# Altium schematic sheet CONNECTEUR_3.SchDoc: DARKYDEN_CONNECTEUR_3
size Letter; ApprovedBy: APPROUVÉ PAR; Author: Harold Malbrouck; Organization: Cegep Limoilou; Address1: 1300, 8e Avenue; Address2: Québec, QC; Address3: Canada; Address4: G1J 5L5; Revision: Rev.C; SheetNumber: 5; SheetTotal: 23
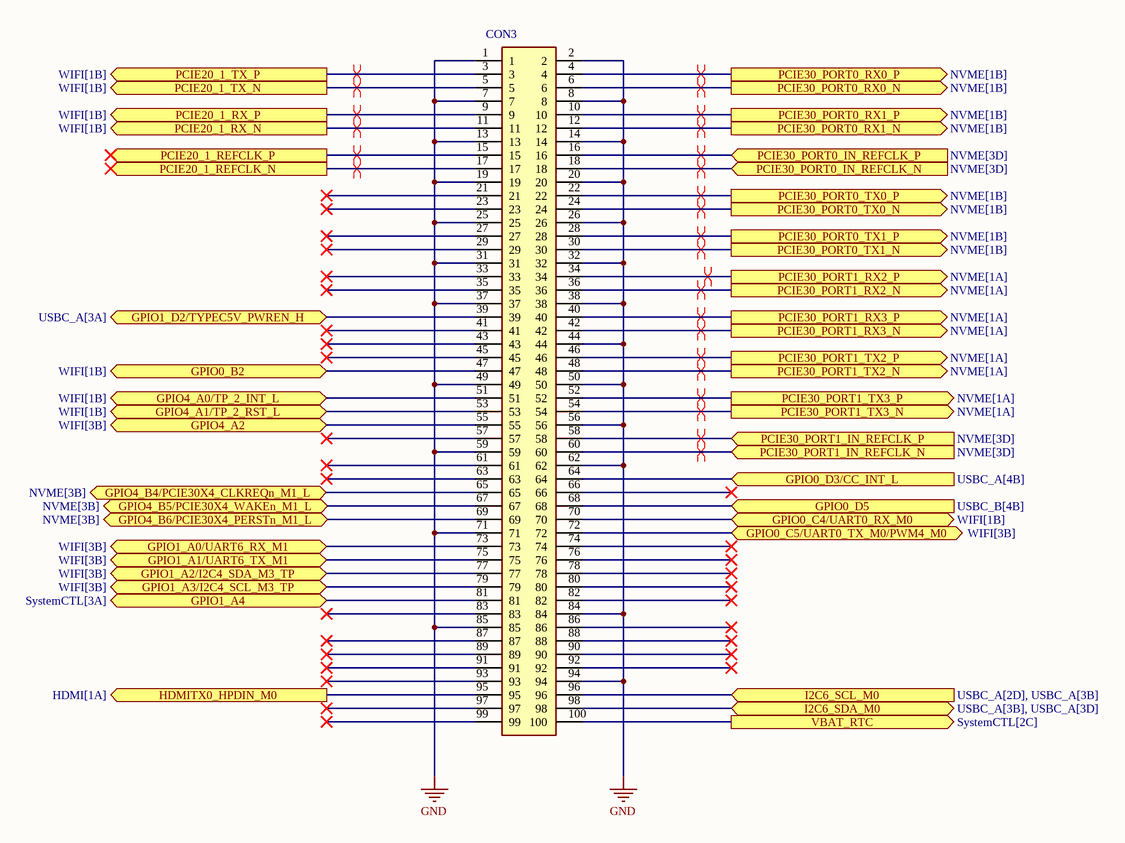
[diagram p0: CONNECTEUR_3.SchDoc]

## Parts
CON3  DF40HC  [DF40HC30100DS04V51_MOD]  (value not drawn)

## Ports
GPIO0_B2 (bidir, see WIFI[1B]), GPIO0_C4/UART0_RX_M0 (bidir, see WIFI[1B]), GPIO0_C5/UART0_TX_M0/PWM4_M0 (bidir, see WIFI[3B]), GPIO0_D3/CC_INT_L (in, see USBC_A[4B]), GPIO0_D5 (in, see USBC_B[4B]), GPIO1_A0/UART6_RX_M1 (bidir, see WIFI[3B]), GPIO1_A1/UART6_TX_M1 (bidir, see WIFI[3B]), GPIO1_A2/I2C4_SDA_M3_TP (bidir, see WIFI[3B]), GPIO1_A3/I2C4_SCL_M3_TP (bidir, see WIFI[3B]), GPIO1_A4 (bidir, see SystemCTL[3A]), GPIO1_D2/TYPEC5V_PWREN_H (bidir, see USBC_A[3A]), GPIO4_A0/TP_2_INT_L (bidir, see WIFI[1B]), GPIO4_A1/TP_2_RST_L (bidir, see WIFI[1B]), GPIO4_A2 (bidir, see WIFI[3B]), GPIO4_B4/PCIE30X4_CLKREQn_M1_L (bidir, see NVME[3B]), GPIO4_B5/PCIE30X4_WAKEn_M1_L (bidir, see NVME[3B]), GPIO4_B6/PCIE30X4_PERSTn_M1_L (bidir, see NVME[3B]), HDMITX0_HPDIN_M0 (out, see HDMI[1A]), I2C6_SCL_M0 (in, see USBC_A[2D], USBC_A[3B]), I2C6_SDA_M0 (bidir, see USBC_A[3B], USBC_A[3D]), PCIE20_1_REFCLK_N (out), PCIE20_1_REFCLK_P (out), PCIE20_1_RX_N (out, see WIFI[1B]), PCIE20_1_RX_P (out, see WIFI[1B]), PCIE20_1_TX_N (out, see WIFI[1B]), PCIE20_1_TX_P (out, see WIFI[1B]), PCIE30_PORT0_IN_REFCLK_N (in, see NVME[3D]), PCIE30_PORT0_IN_REFCLK_P (in, see NVME[3D]), PCIE30_PORT0_RX0_N (out, see NVME[1B]), PCIE30_PORT0_RX0_P (out, see NVME[1B]), PCIE30_PORT0_RX1_N (out, see NVME[1B]), PCIE30_PORT0_RX1_P (out, see NVME[1B]), PCIE30_PORT0_TX0_N (out, see NVME[1B]), PCIE30_PORT0_TX0_P (out, see NVME[1B]), PCIE30_PORT0_TX1_N (out, see NVME[1B]), PCIE30_PORT0_TX1_P (out, see NVME[1B]), PCIE30_PORT1_IN_REFCLK_N (in, see NVME[3D]), PCIE30_PORT1_IN_REFCLK_P (in, see NVME[3D]), PCIE30_PORT1_RX2_N (out, see NVME[1A]), PCIE30_PORT1_RX2_P (out, see NVME[1A]), PCIE30_PORT1_RX3_N (out, see NVME[1A]), PCIE30_PORT1_RX3_P (out, see NVME[1A]), PCIE30_PORT1_TX2_N (out, see NVME[1A]), PCIE30_PORT1_TX2_P (out, see NVME[1A]), PCIE30_PORT1_TX3_N (out, see NVME[1A]), PCIE30_PORT1_TX3_P (out, see NVME[1A]), VBAT_RTC (out, see SystemCTL[2C])

## Nets
GND: CON3.1 CON3.2 CON3.7 CON3.8 CON3.13 CON3.14 CON3.19 CON3.20 CON3.25 CON3.26 CON3.31 CON3.32 CON3.37 CON3.38 CON3.44 CON3.49 CON3.50 CON3.56 CON3.59 CON3.62 CON3.71 CON3.84 CON3.85 CON3.94
GPIO0_B2: CON3.47 ; port GPIO0_B2
GPIO0_C4/UART0_RX_M0: CON3.70 ; port GPIO0_C4/UART0_RX_M0
GPIO0_C5/UART0_TX_M0/PWM4_M0: CON3.72 ; port GPIO0_C5/UART0_TX_M0/PWM4_M0
GPIO0_D3/CC_INT_L: CON3.64 ; port GPIO0_D3/CC_INT_L
GPIO0_D5: CON3.68 ; port GPIO0_D5
GPIO1_A0/UART6_RX_M1: CON3.73 ; port GPIO1_A0/UART6_RX_M1
GPIO1_A1/UART6_TX_M1: CON3.75 ; port GPIO1_A1/UART6_TX_M1
GPIO1_A2/I2C4_SDA_M3_TP: CON3.77 ; port GPIO1_A2/I2C4_SDA_M3_TP
GPIO1_A3/I2C4_SCL_M3_TP: CON3.79 ; port GPIO1_A3/I2C4_SCL_M3_TP
GPIO1_A4: CON3.81 ; port GPIO1_A4
GPIO1_D2/TYPEC5V_PWREN_H: CON3.39 ; port GPIO1_D2/TYPEC5V_PWREN_H
GPIO4_A0/TP_2_INT_L: CON3.51 ; port GPIO4_A0/TP_2_INT_L
GPIO4_A1/TP_2_RST_L: CON3.53 ; port GPIO4_A1/TP_2_RST_L
GPIO4_A2: CON3.55 ; port GPIO4_A2
GPIO4_B4/PCIE30X4_CLKREQn_M1_L: CON3.65 ; port GPIO4_B4/PCIE30X4_CLKREQn_M1_L
GPIO4_B5/PCIE30X4_WAKEn_M1_L: CON3.67 ; port GPIO4_B5/PCIE30X4_WAKEn_M1_L
GPIO4_B6/PCIE30X4_PERSTn_M1_L: CON3.69 ; port GPIO4_B6/PCIE30X4_PERSTn_M1_L
HDMITX0_HPDIN_M0: CON3.95 ; port HDMITX0_HPDIN_M0
I2C6_SCL_M0: CON3.96 ; port I2C6_SCL_M0
I2C6_SDA_M0: CON3.98 ; port I2C6_SDA_M0
PCIE20_1_REFCLK_N: CON3.17 ; port PCIE20_1_REFCLK_N
PCIE20_1_REFCLK_P: CON3.15 ; port PCIE20_1_REFCLK_P
PCIE20_1_RX_N: CON3.11 ; port PCIE20_1_RX_N
PCIE20_1_RX_P: CON3.9 ; port PCIE20_1_RX_P
PCIE20_1_TX_N: CON3.5 ; port PCIE20_1_TX_N
PCIE20_1_TX_P: CON3.3 ; port PCIE20_1_TX_P
PCIE30_PORT0_IN_REFCLK_N: CON3.18 ; port PCIE30_PORT0_IN_REFCLK_N
PCIE30_PORT0_IN_REFCLK_P: CON3.16 ; port PCIE30_PORT0_IN_REFCLK_P
PCIE30_PORT0_RX0_N: CON3.6 ; port PCIE30_PORT0_RX0_N
PCIE30_PORT0_RX0_P: CON3.4 ; port PCIE30_PORT0_RX0_P
PCIE30_PORT0_RX1_N: CON3.12 ; port PCIE30_PORT0_RX1_N
PCIE30_PORT0_RX1_P: CON3.10 ; port PCIE30_PORT0_RX1_P
PCIE30_PORT0_TX0_N: CON3.24 ; port PCIE30_PORT0_TX0_N
PCIE30_PORT0_TX0_P: CON3.22 ; port PCIE30_PORT0_TX0_P
PCIE30_PORT0_TX1_N: CON3.30 ; port PCIE30_PORT0_TX1_N
PCIE30_PORT0_TX1_P: CON3.28 ; port PCIE30_PORT0_TX1_P
PCIE30_PORT1_IN_REFCLK_N: CON3.60 ; port PCIE30_PORT1_IN_REFCLK_N
PCIE30_PORT1_IN_REFCLK_P: CON3.58 ; port PCIE30_PORT1_IN_REFCLK_P
PCIE30_PORT1_RX2_N: CON3.36 ; port PCIE30_PORT1_RX2_N
PCIE30_PORT1_RX2_P: CON3.34 ; port PCIE30_PORT1_RX2_P
PCIE30_PORT1_RX3_N: CON3.42 ; port PCIE30_PORT1_RX3_N
PCIE30_PORT1_RX3_P: CON3.40 ; port PCIE30_PORT1_RX3_P
PCIE30_PORT1_TX2_N: CON3.48 ; port PCIE30_PORT1_TX2_N
PCIE30_PORT1_TX2_P: CON3.46 ; port PCIE30_PORT1_TX2_P
PCIE30_PORT1_TX3_N: CON3.54 ; port PCIE30_PORT1_TX3_N
PCIE30_PORT1_TX3_P: CON3.52 ; port PCIE30_PORT1_TX3_P
VBAT_RTC: CON3.100 ; port VBAT_RTC

Not connected (* = marked no-connect by the designer): CON3 21* 23* 27* 29* 33* 35* 41* 43* 45* 57* 61* 63* 66* 74* 76* 78* 80* 82* 83* 86* 87* 88* 89* 90* 91* 92* 93* 97* 99*

## Layout directives
differential pair: PCIE20_1_REFCLK_N, PCIE20_1_REFCLK_P, PCIE20_1_RX_N, PCIE20_1_RX_P, PCIE20_1_TX_N, PCIE20_1_TX_P, PCIE30_PORT0_IN_REFCLK_N, PCIE30_PORT0_IN_REFCLK_P, PCIE30_PORT0_RX0_N, PCIE30_PORT0_RX0_P, PCIE30_PORT0_RX1_N, PCIE30_PORT0_RX1_P, PCIE30_PORT0_TX0_N, PCIE30_PORT0_TX0_P, PCIE30_PORT0_TX1_N, PCIE30_PORT0_TX1_P, PCIE30_PORT1_IN_REFCLK_N, PCIE30_PORT1_IN_REFCLK_P, PCIE30_PORT1_RX2_N, PCIE30_PORT1_RX2_P, PCIE30_PORT1_RX3_N, PCIE30_PORT1_RX3_P, PCIE30_PORT1_TX2_N, PCIE30_PORT1_TX2_P, PCIE30_PORT1_TX3_N, PCIE30_PORT1_TX3_P

## Notes on the sheet
- Titre :
- Conception :
- Date :
- Approbation :
- Heure :
- Révision :
- Feuille
- de
- Fichier :

## Library data of the parts
CON3 = DF40HC(3.0)-100DS-0.4V(51): Stacking Board Connector, DF40 Series, Receptacle, 0.4 mm, 100, Surface Mount, G; Manufacturer_Name: Hirose; Number of Positions: 100; Contact Resistance: 90mR; Contact Voltage Rating (AC): 30V; Current Rating: 300mA; Mated Stacking Heights: 3mm; Contact Pitch: 400um; Datasheet Link: https://componentsearchengine.com/Datasheets/1/DF40HC(3.0)-100DS-0.4V(51.pdf; Height: 3.05mm; Manufacturer_Part_Number: DF40HC(3.0)-100DS-0.4V(51; Mouser Part Number: 798-DF40HC30100DS451; Mouser Price/Stock: https://www.mouser.co.uk/ProductDetail/Hirose-Connector/DF40HC3.0-100DS-0.4V51?qs=%252BAZVS4b%2FkgIV%252B3vHYy2dCA%3D%3D; Arrow Part Number: DF40HC(3.0)-100DS-0.4V(51; Arrow Price/Stock: https://www.arrow.com/en/products/df40hc-3.0-100ds-0.4v-51/hirose-electric; Supplier: Digikey; Supplier Part Number: 26-DF40HC(3.0)-100DS-0.4V(51)CT-ND; Manufacturer: Hirose; Manufacturer Part Number: DF40HC(3.0)-100DS-0.4V(51; RoHS: Yes; Category: Headers and Wire Housings; Stock: 5604; Pricing: 1=2.61, 10=2.219, 25=2.0796, 50=1.9804, 100=1.8858, 250=1.76764, 500=1.68326, 1000=1.6524 (USD); Mounting Technology: Surface Mount; Contact Plating: Gold; Contact Material: Nickel,Gold; Housing Color: Black; Min Operating Temperature: -35°C; Max Operating Temperature: 85°C; Package Quantity: 3000; Packaging: Tape and Reel; Number of Rows: 2; Connector Type: Receptacle; Series: DF40; Contact Voltage Rating (DC): 30V; Number of Contacts: 100; Orientation: Straight; Voltage Rating: 30V; Length: 22.6mm; Width: 3.38mm; ComponentLink1URL: https://datasheet.ciiva.com/13559/ed-df40-20140305-13559540.pdf?src-supplier=Mouser; ComponentLink1Description: https://datasheet.ciiva.com/13559/ed-df40-20140305-13559540.pdf?src-supplier=Mouser